# EAGLE design adcAlpha (EAGLE 9.6.2)
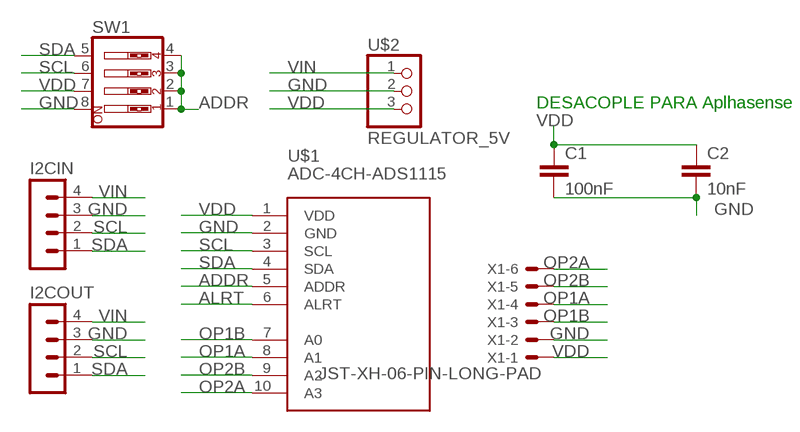
[diagram p0: schematic, sheet 1]

## Parts
C1  100nF  0.1UF-KIT-EZ-50V-20%  [CAP-PTH-SMALL-KIT]
C2  10nF  0.1UF-KIT-EZ-50V-20%  [CAP-PTH-SMALL-KIT]
I2CIN  MA04-1  [MA04-1]
I2COUT  MA04-1  [MA04-1]
SW1  SW_DIP-4  [EDG-04]
U$1  ADC-4CH-ADS1115  [ADC-4CH-ADS1115]
U$2  REGULATOR_5V  [1X03]
X1  JST-XH-06-PIN-LONG-PAD  [JST-XH-06-PACKAGE-LONG-PAD]

## Nets
ADDR: SW1.1 SW1.2 SW1.3 SW1.4 U$1.5(ADDR)
ALRT: U$1.6(ALRT)
GND: C1.2 C2.2 I2CIN.3 I2COUT.3 SW1.8 U$1.2(GND) U$2.2(GND) X1.2
OP1A: U$1.8(A1) X1.4
OP1B: U$1.7(A0) X1.3
OP2A: U$1.10(A3) X1.6
OP2B: U$1.9(A2) X1.5
SCL: I2CIN.2 I2COUT.2 SW1.6 U$1.3(SCL)
SDA: I2CIN.1 I2COUT.1 SW1.5 U$1.4(SDA)
VDD: C1.1 C2.1 SW1.7 U$1.1(VDD) U$2.3(OUT5V) X1.1
VIN: I2CIN.4 I2COUT.4 U$2.1(IN)

## Notes on the sheet
- DESACOPLE PARA Aplhasense

## Library data of the parts
C1 C2 = SparkFun-Capacitors:0.1UF: 0.1µF ceramic capacitors A capacitor is a passive two-terminal electrical component used to store electrical energy temporarily in an electric field.; PROD_ID: CAP-08370; VALUE: 0.1uF
I2CIN I2COUT = con-lstb:MA04-1: PIN HEADER; OC_FARNELL: unknown; OC_NEWARK: unknown
SW1 = special:SW_DIP-4: DIP SWITCH
U$1 = diy-modules:ADC-4CH-ADS1115: 4 Channel 16-Bit Analog-to-Digital Converter based on ADS1115 chip Arduino ADS1115 Getting Started Tutorial is available here: http://henrysbench.capnfatz.com/henrys-bench/arduino-voltage-measurements/arduino-ads1115-module-getting-started-tutorial/ ADS1115 datasheet is available here: http://www.ti.com/lit/ds/symlink/ads1115.pdf Click here to find device on ebay.com <http://www.ebay.com/sch/ads1115+module>
U$2 = REG5v:REGULATOR_5V
X1 = Rembrandt Electronics - JST XH Connectors v1-0:JST-XH-06-PIN: JST XH Connector 2 Pin Wire to board connector. Pitch: 2,54 mm, (0.100") Number of pins: 6 Created by Rembrandt Electronics www.rembrandtelectronics.com

## Board
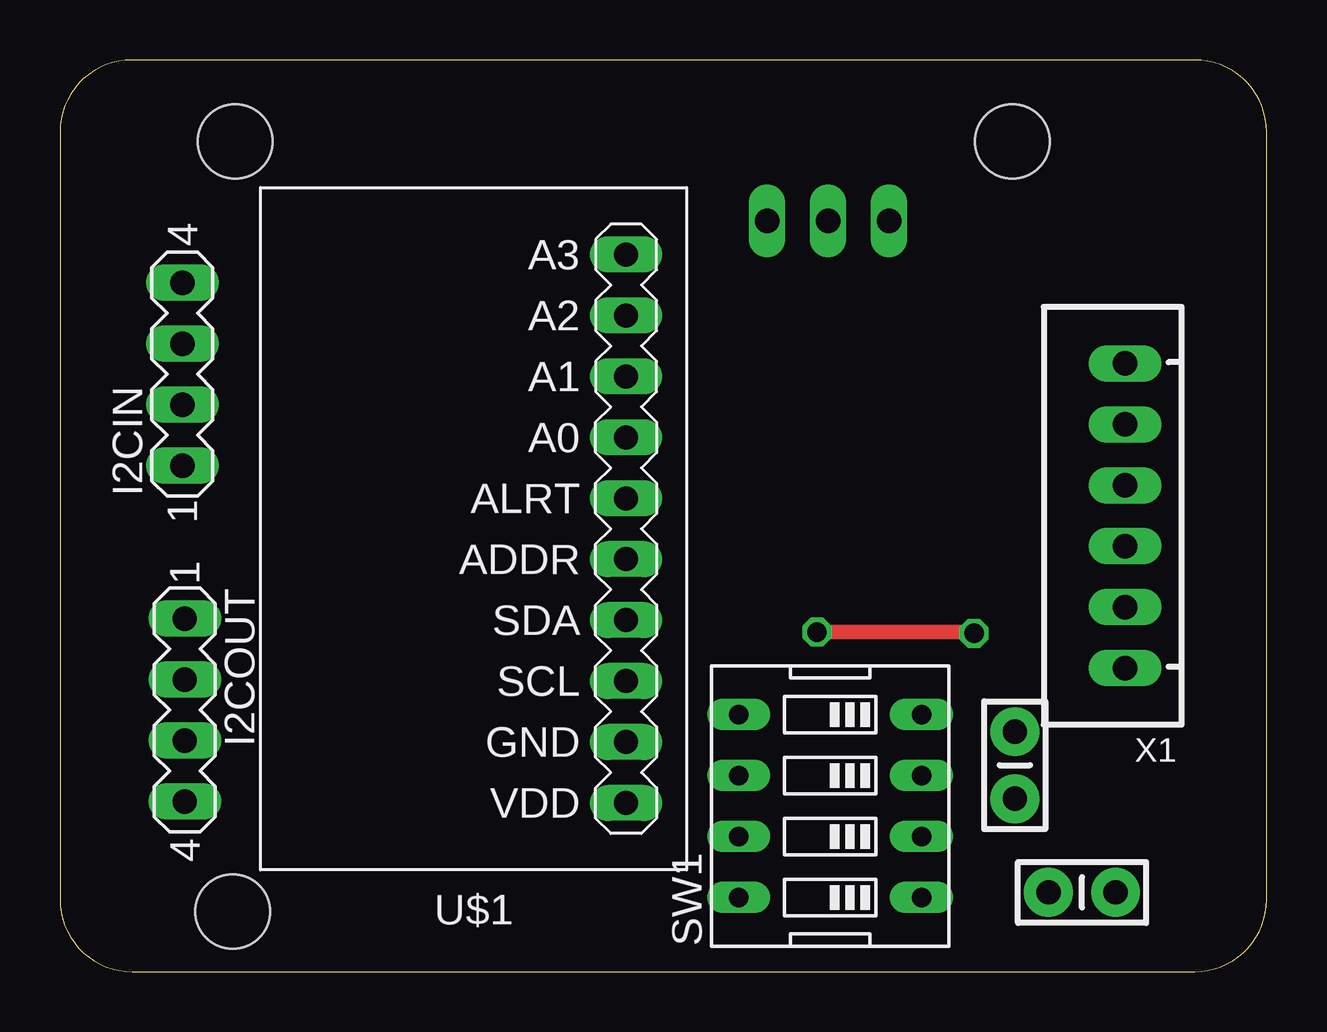
[diagram p1: board, top side]
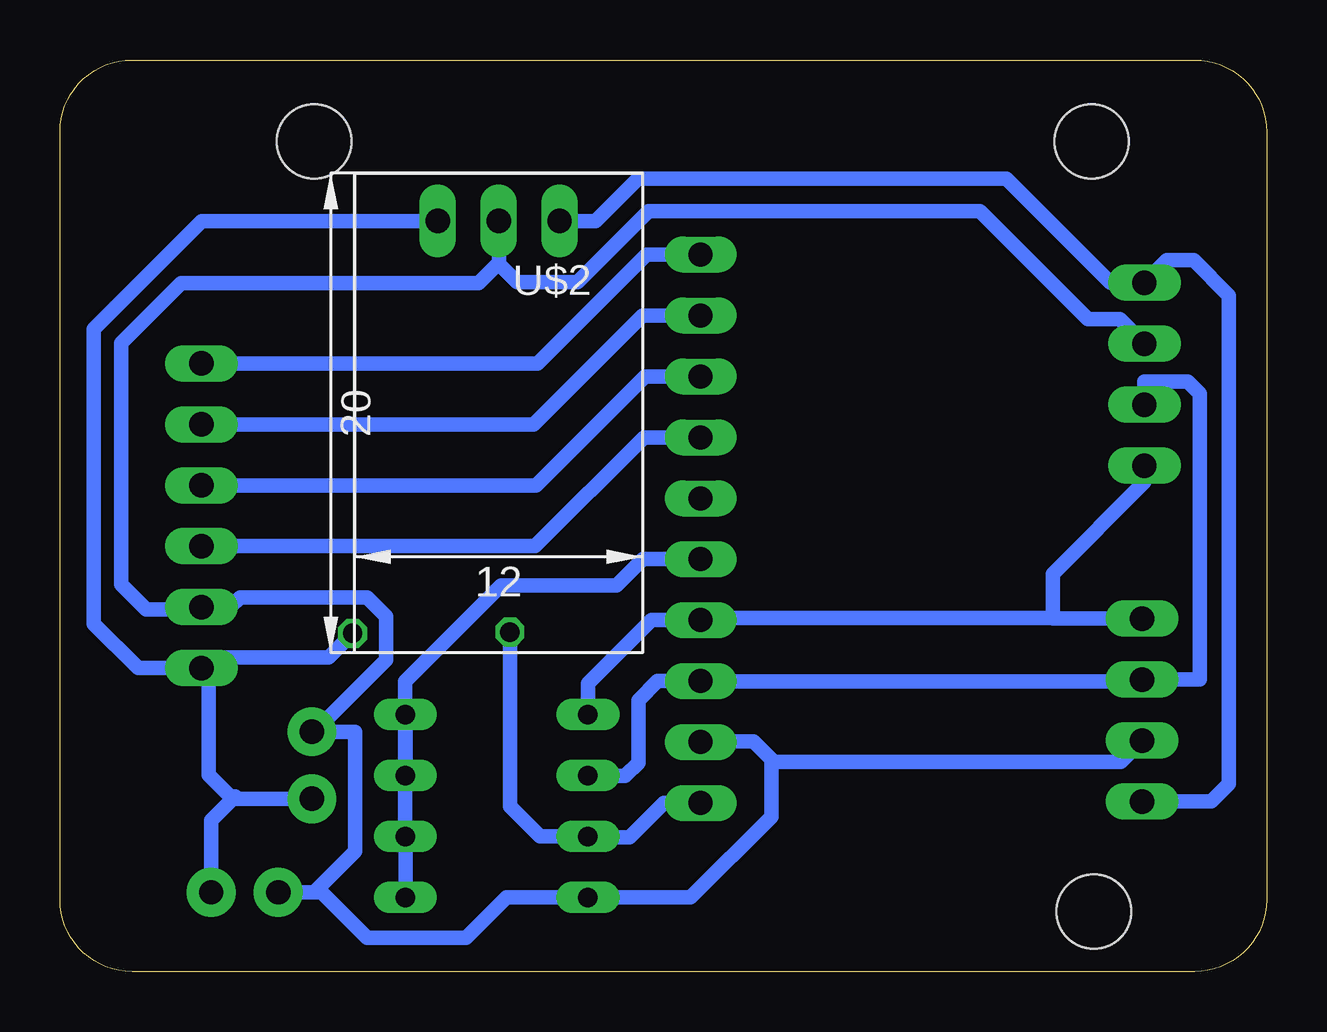
[diagram p2: board, bottom side, seen from below]

Size 50.3 x 38 mm. Coordinates in mm from the lower left corner, seen from the top.
Outline: 0,35 0,3 arc90 3,0 47.3,0 arc90 50.3,3 50.3,35 arc90 47.3,38 3,38 arc90 0,35
Copper layers (1*16): Top 0.035mm / dielectric 1.5mm / Bottom 0.035mm
Design rules "default *": minimum track width 0.4mm, minimum drill 0.8mm, track to track 0.4mm, track to pad 0.4mm, pad to pad 0.4mm, via to via 0.4mm, smd to smd 6mil, copper to edge 40mil, drill to drill 6mil, minimum pad ring 10mil, minimum via ring 8mil, stop-mask expansion 4mil, vias tented up to drill 0mil, thermal gap 10mil
Holes 3.1 mm at 7.3,34.6 39.7,34.6 7.2,2.5

### Footprints (pad centres in the part's own frame; a part is rotated, then mirrored left to right if it is on the bottom)
CAP-PTH-SMALL-KIT = drill 1.016 pad 2.032: 1 -1.397,0; 2 1.397,0
MA04-1 = drill 1.016 long: 1 -3.81,0; 2 -1.27,0; 3 1.27,0; 4 3.81,0
EDG-04 = drill 0.813 long: 1 -3.81,-3.81; 2 -1.27,-3.81; 3 1.27,-3.81; 4 3.81,-3.81; 5 3.81,3.81; 6 1.27,3.81; 7 -1.27,3.81; 8 -3.81,3.81
ADC-4CH-ADS1115 = drill 1 long: 1 -6.35,11.43; 2 -6.35,8.89; 3 -6.35,6.35; 4 -6.35,3.81; 5 -6.35,1.27; 6 -6.35,-1.27; 7 -6.35,-3.81; 8 -6.35,-6.35; 9 -6.35,-8.89; 10 -6.35,-11.43
1X03 = drill 1.016 long: 1 -2.54,0; 2 0,0; 3 2.54,0
JST-XH-06-PACKAGE-LONG-PAD = drill 1.016 long: 1 -6.35,0; 2 -3.81,0; 3 -1.27,0; 4 1.27,0; 5 3.81,0; 6 6.35,0

### Placement (x,y rotation side)
C1  42.6,3.3 180 top
C2  39.8,8.6 90 top
I2CIN  5.1,24.9 90 top
I2COUT  5.2,10.9 270 top
SW1  32.1,6.9 90 top
U$1  17.25,18.46 180 top
U$2  32.02,31.29 180 bottom
X1  44.4,19 90 top

### Tracks (layer width: path | path; a pad name or v marks a point on that pad's centre or on a via)
ADDR
  Bottom 0.61: SW1.3 35.9,10.6 35.85,10.65 SW1.4 | SW1.1 35.9,5.35 35.85,5.4 SW1.2 35.89,5.64 35.91,5.66 SW1.3 | SW1.3 35.91,12.09 31.91,16.09 27.09,16.09 26,17.19 U$1.5
GND
  Bottom 0.61: 32,29.55 32,31.15 U$2.2 | 32,29.55 32,29.5 31.25,28.75 28.73,28.75 25.78,31.7 11.95,31.7 7.45,27.2 6.13,27.2 I2CIN.3 | 20.65,8.75 20.65,8.85 21.4,9.6 23.56,9.6 U$1.2 | 20.65,8.75 20.65,6.45 24.01,3.09 SW1.8 31.69,3.09 33.38,1.4 37.5,1.4 39.4,3.3 C1.2 39.7,3.3 38,5 38,10 C2.2 39.7,10 36.7,13 36.7,14.8 37.5,15.6 42.8,15.6 43.21,15.19 X1.2 44.5,15.09 46.7,15.09 47.75,16.14 47.75,26.2 45.25,28.7 32.85,28.7 32,29.55 | 20.65,8.75 6.08,8.75 I2COUT.3
OP1A
  Bottom 0.61: U$1.8 25.92,24.81 30.46,20.27 X1.4
OP1B
  Bottom 0.61: U$1.7 25.96,22.27 30.5,17.73 X1.3
OP2A
  Bottom 0.61: U$1.10 25.86,29.89 30.4,25.35 X1.6
OP2B
  Bottom 0.61: U$1.9 26.01,27.35 30.55,22.81 X1.5
SCL
  Bottom 0.61: SW1.6 28.1,8.15 26.75,8.15 26.2,8.71 26.2,11.31 25.39,12.11 U$1.3 5.27,12.1 I2COUT.2 2.79,12.17 2.79,24.09 3.3,24.6 5.1,24.6 I2CIN.2
SDA
  Bottom 0.61: SW1.5 28.29,12.01 25.65,14.65 U$1.4 23.5,14.75 8.93,14.75 | I2CIN.1 5.1,20.4 8.93,16.57 8.93,14.75 | 8.93,14.75 8.93,14.71 8.92,14.71 I2COUT.1
VDD  (via drill 0.8)
  Top 0.61: v38.1,14.1 38.05,14.15 v31.55,14.15
  Bottom 0.61: U$1.1 25.12,7.03 26.55,5.6 28.27,5.6 SW1.7 30.29,5.63 31.54,6.88 31.54,13.83 31.55,13.84 v31.55,14.15 | U$2.3 44.39,31.29 48.9,26.78 48.9,14.5 47.05,12.65 X1.1 44.1,12.35 44.1,8.2 43.1,7.2 C2.1 43,7.2 43,7.3 44,6.3 C1.1 | v38.1,14.1 39.1,13.1 44.1,13.1
VIN
  Bottom 0.61: U$2.1 27.98,31.29 26.21,33.05 10.85,33.05 6.51,28.71 I2CIN.4 4.16,29.65 3.05,29.65 1.58,28.18 1.58,7.82 2.31,7.09 I2COUT.4